# EAGLE design EMP3 (EAGLE 6.6.0)
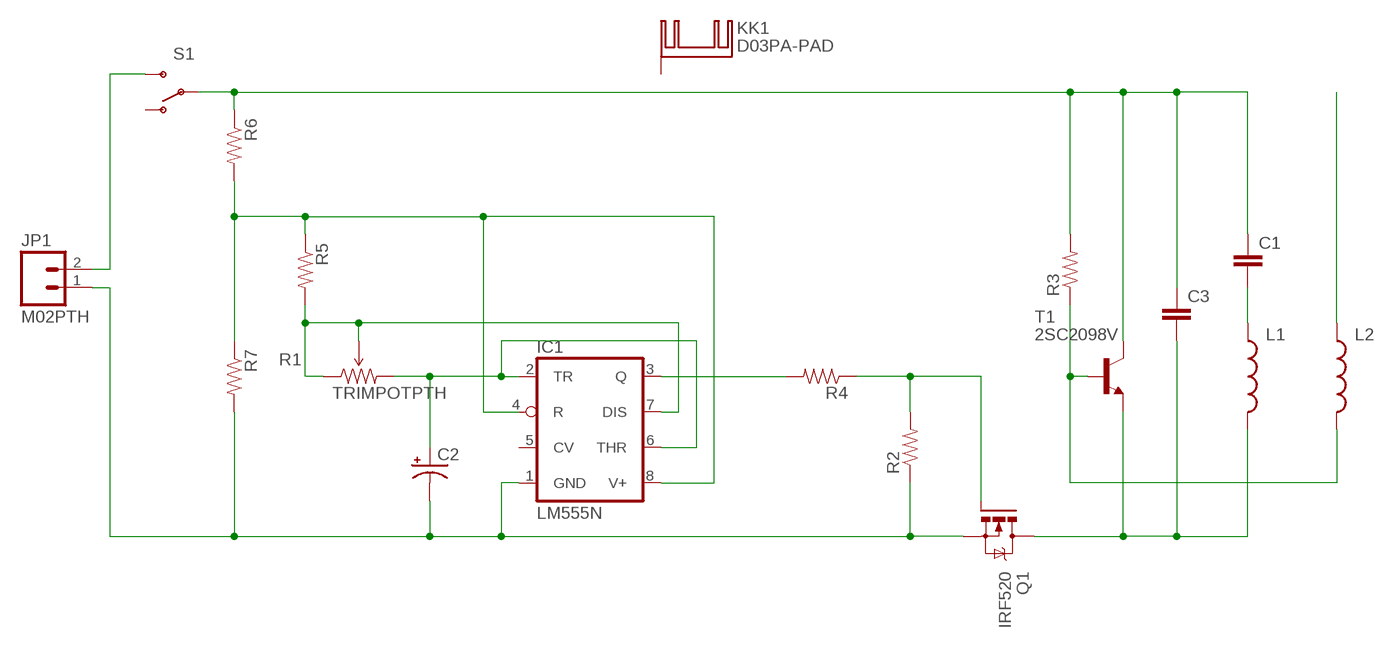
[diagram p0: schematic, sheet 1]

## Parts
C1  CAPEZ  [CAP-PTH-SMALLEZ]
C2  CAP_POLPTH2  [CPOL-RADIAL-10UF-25V]
C3  CAPEZ  [CAP-PTH-SMALLEZ]
IC1  LM555N  [DIL08-ROUND]
JP1  M02PTH  [1X02]
KK1  D03PA-PAD  [D03PA-PAD]
L1  INDUCTORCR54-KIT  [CR54-KIT]
L2  INDUCTORCR54-KIT  [CR54-KIT]
Q1  IRF520  [TO220BV]
R1  TRIMPOTPTH  [TRIM_POT_PTH]
R2  RESISTOREZ  [AXIAL-0.3EZ]
R3  RESISTOREZ  [AXIAL-0.3EZ]
R4  RESISTOREZ  [AXIAL-0.3EZ]
R5  RESISTOREZ  [AXIAL-0.3EZ]
R6  RESISTOREZ  [AXIAL-0.3EZ]
R7  RESISTOREZ  [AXIAL-0.3EZ]
S1  SWITCH-SPDTPTH  [SWITCH-SPDT]
T1  2SC2098V  [TO220AV]

## Nets
GND: C2.2(-) IC1.1(GND) JP1.1 Q1.S R2.P$1 R7.P$2
N$1: C1.2 L1.P$1
N$2: L2.P$1
N$4: L2.P$2 R3.P$1 T1.1(B)
N$6: C3.2 L1.P$2 Q1.D T1.3(E)
N$9: Q1.G R2.P$2 R4.P$1
N$11: IC1.3(Q) R4.P$2
N$13: C2.1(+) IC1.2(TR) IC1.6(THR) R1.3(CW)
N$15: IC1.7(DIS) R1.1(CCW) R1.2(WIPER) R5.P$2
N$18: IC1.4(R) IC1.8(V+) R5.P$1 R6.P$2 R7.P$1
N$22: C1.1 C3.1 R3.P$2 R6.P$1 S1.2(P) T1.2(C)
N$23: JP1.2 S1.3(S)
Unconnected: IC1.5(CV) KK1.B(K) S1.1(O)

## Library data of the parts
C1 C3 = SparkFun-Capacitors:CAP: Capacitor Standard 0603 ceramic capacitor, and 0.1" leaded capacitor.
C2 = SparkFun-Capacitors:CAP_POL: Capacitor Polarized These are standard SMD and PTH capacitors. Normally 10uF, 47uF, and 100uF in electrolytic and tantalum varieties. Always verify the external diameter of the through hole cap, it varies with capacity, voltage, and manufacturer. The EIA devices should be standard.
IC1 = adafruit:*555: TIMER Changed DIP package to have round (not oval) pin pads http://www.ladyada.net/library/pcb/eaglelibrary.html
JP1 = SparkFun-Connectors:M02: Standard 2-pin 0.1" header. Use with - straight break away headers ( PRT-00116) - right angle break away headers (PRT-00553) - swiss pins (PRT-00743) - machine pins (PRT-00117) - female headers (PRT-00115) Molex polarized connector foot print use with: PRT-08233 with associated crimp pins and housings. 2.54_SCREWTERM for use with PRT-10571. 3.5mm Screw Terminal footprints for PRT-08084 5mm Screw Terminal footprints for use with PRT-08433
KK1 = heatsink:D03PA-PAD: HEATSINK distributor Schukat
L1 L2 = SparkFun-Passives:INDUCTOR: Inductors Basic Inductor/Choke - 0603 and 1206. Footprints are not proven and vary greatly between part numbers. SRN6045- 33uH, 20% 1.4A SDR0403-560KL - 56uH, 10%, 500mA RMS/740mA peak
Q1 = transistor-power:IRF520: HEXFET Power MOSFET
R1 = SparkFun-Electromechanical:TRIMPOT: Various small potentiometers for "set-and-forget" applications
R2-R7 = SparkFun-Resistors:RESISTOR: Resistor Basic schematic elements and footprints for 0603, 1206, and PTH resistors.
S1 = SparkFun-Electromechanical:SWITCH-SPDT: SPDT Switch Simple slide switch, Spark Fun Electronics SKU : COM-00102 DPDT SMT slide switch, AYZ0202, SWCH-08179
T1 = transistor:2SC2098: NPN Epitaxial Planar Transistor RF Power Amplivier Source: 2SC2098.pdf

## Board
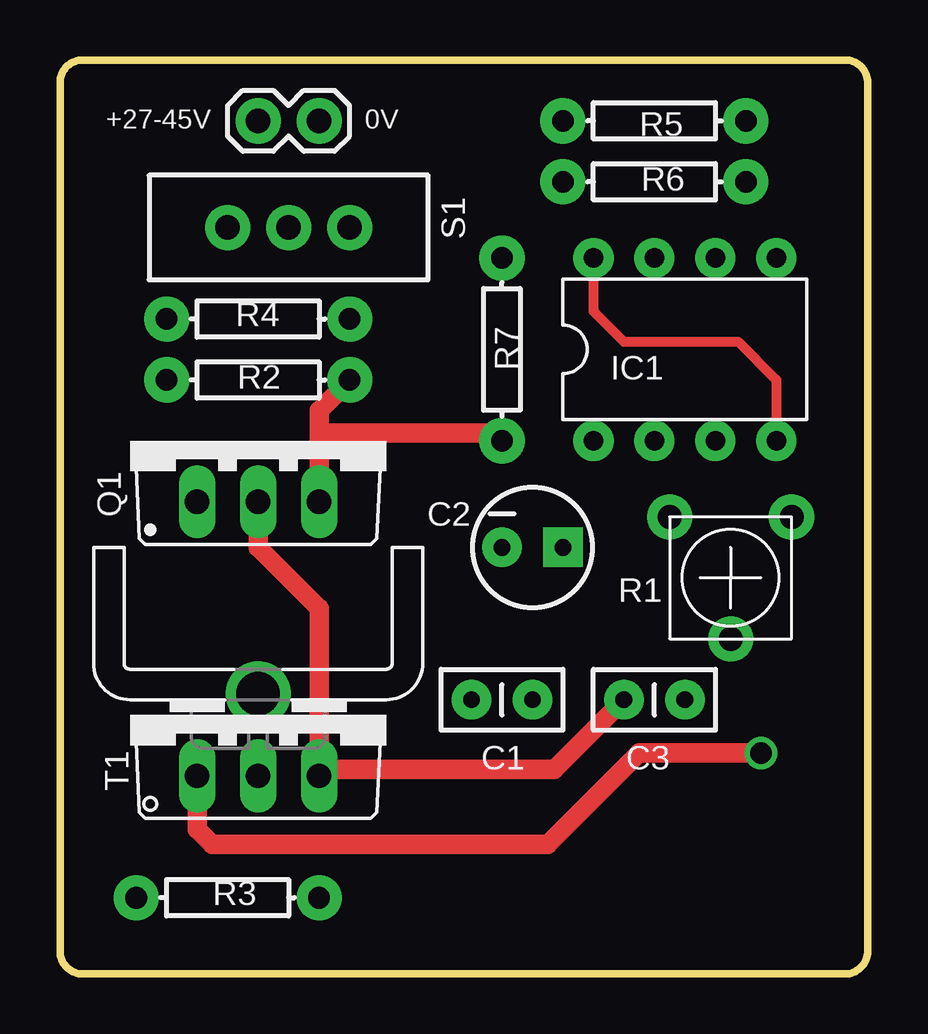
[diagram p1: board, top side]
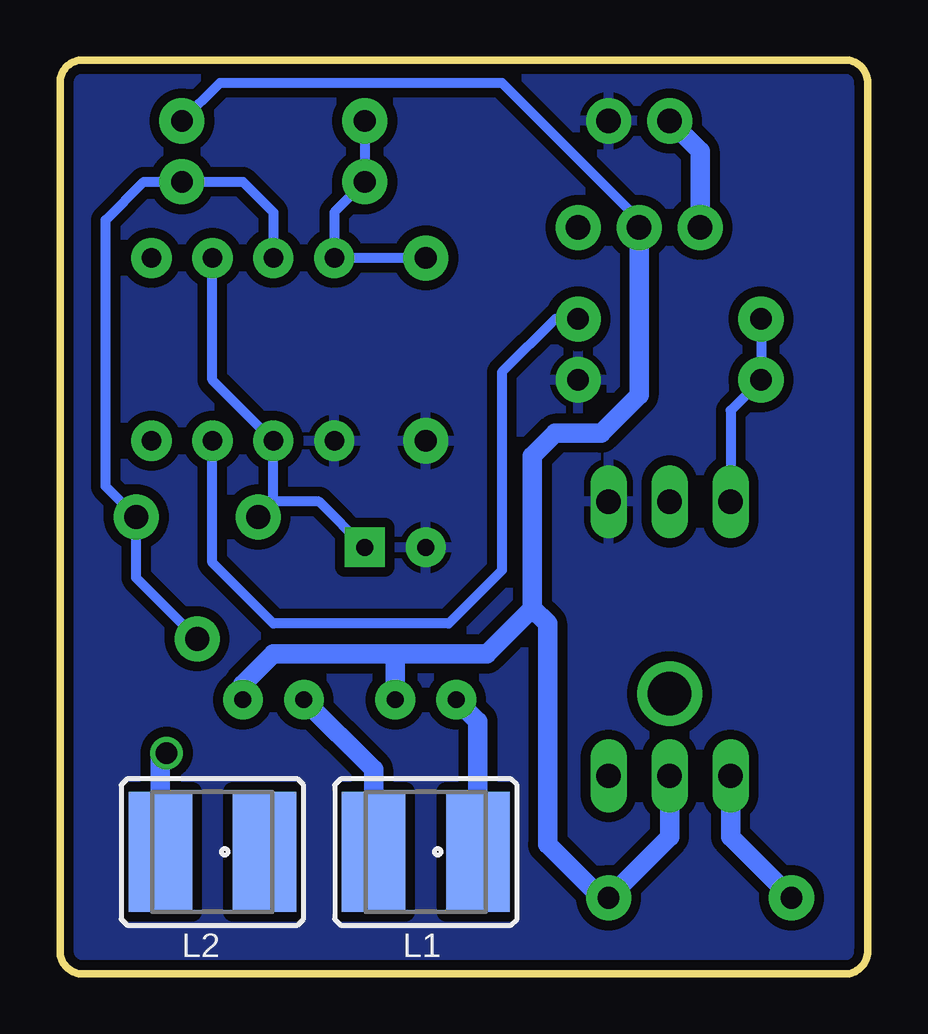
[diagram p2: board, bottom side, seen from below]

Size 33.66 x 38.1 mm. Coordinates in mm from the lower left corner, seen from the top.
Outline: 0,37.15 0,0.95 arc90 0.95,0 32.7,0 arc90 33.66,0.95 33.66,37.15 arc90 32.7,38.1 0.95,38.1 arc90 0,37.15
Copper layers (1*16): Top 0.035mm / dielectric 1.5mm / Bottom 0.035mm
Design rules "SeeedStudio_2layer_DRU_no_angle_20140221": minimum track width 6mil, minimum drill 12mil, track to track 6mil, track to pad 6mil, pad to pad 6mil, via to via 6mil, smd to smd 0mil, copper to edge 10mil, drill to drill 10mil, minimum pad ring 10mil, minimum via ring 6mil, stop-mask expansion 2mil, vias tented up to drill 100mil, thermal gap 10mil

### Footprints (pad centres in the part's own frame; a part is rotated, then mirrored left to right if it is on the bottom)
CAP-PTH-SMALLEZ = drill 0.7 pad 1.651: 1 0,0; 2 2.54,0
CPOL-RADIAL-10UF-25V = drill 0.7 pad 1.651 square: 1 1.27,0 | drill 0.7 pad 1.651: 2 -1.27,0
DIL08-ROUND = drill 0.813 pad 1.676: 1 -3.81,-3.81; 2 -1.27,-3.81; 3 1.27,-3.81; 4 3.81,-3.81; 5 3.81,3.81; 6 1.27,3.81; 7 -1.27,3.81; 8 -3.81,3.81
1X02 = drill 1.016 pad 1.88: 1 0,0; 2 2.54,0
D03PA-PAD = drill 1.803 pad 2.54: B 0,-1.016
CR54-KIT = smd 5 x 2.65: P$1 0,2.17; P$2 0,-2.17
TO220BV = drill 1.016 long: D 0,-2.54; G -2.54,-2.54; S 2.54,-2.54
TRIM_POT_PTH = drill 1 pad 1.88: 1 -2.54,-2.54; 2 0,2.54; 3 2.54,-2.54
AXIAL-0.3EZ = drill 0.9 pad 1.88: P$1 -3.81,0; P$2 3.81,0
SWITCH-SPDT = drill 1.016 pad 1.88: 1 0,2.54; 2 0,0; 3 0,-2.54
TO220AV = drill 1.016 long: 1 -2.54,-2.54; 2 0,-2.54; 3 2.54,-2.54

### Placement (x,y rotation side)
C1  19.68,11.43 180 top
C2  19.68,17.78 0 top
C3  26.04,11.43 180 top
IC1  26.04,26.04 0 top
JP1  10.79,35.56 180 top
KK1  8.26,12.7 0 top
L1  18.41,5.08 270 bottom
L2  27.3,5.08 270 bottom
Q1  8.26,22.23 0 top
R1  27.94,16.51 180 top
R2  8.26,24.77 180 top
R3  6.99,3.17 0 top
R4  8.26,27.3 0 top
R5  24.77,33.02 0 top
R6  24.77,35.56 180 top
R7  18.41,26.04 270 top
S1  9.53,31.11 270 top
T1  8.26,10.79 0 top

### Tracks (layer width: path | path; a pad name or v marks a point on that pad's centre or on a via)
GND
  Top 0.813: R2.P$1 10.79,23.5 10.79,22.54 | 10.79,22.54 Q1.S | R7.P$2 18.1,22.54 10.79,22.54
  pour Bottom (isolate 0.406): 33.66,37.15 33.66,0.95 arc-90 32.7,0 0.95,0 arc-90 0,0.95 0,37.15 arc-90 0.95,38.1 32.7,38.1 arc-90
N$1
  Bottom 0.813: C1.2 16.25,10.53 L1.P$1
N$4  (via drill 0.9)
  Top 0.813: v29.21,9.21 24.13,9.21 20.32,5.4 6.35,5.4 5.71,6.03 T1.1
  Bottom 0.813: R3.P$1 5.71,5.71 T1.1 | L2.P$2 29.48,8.94 v29.21,9.21
N$6
  Top 0.813: Q1.D 8.26,17.78 10.79,15.24 T1.3 11.06,8.52 20.59,8.52 C3.2
  Bottom 0.813: C3.2 20.59,8.52 L1.P$2
N$9
  Bottom 0.406: R4.P$1 R2.P$2 5.71,23.5 Q1.G
N$11
  Bottom 0.406: R4.P$2 13.02,27.3 15.24,25.08 15.24,16.83 17.46,14.61 24.77,14.61 27.3,17.14 IC1.3
N$13
  Bottom 0.406: C2.1 22.86,19.68 24.77,19.68 | 24.77,19.68 IC1.2 27.3,24.77 IC1.6 | R1.3 24.77,19.68
N$15
  Bottom 0.406: IC1.7 24.77,31.75 26.04,33.02 R5.P$2 30.16,33.02 31.75,31.43 31.75,20.32 R1.1 30.48,16.51 R1.2
N$18
  Top 0.406: IC1.8 22.23,27.62 23.5,26.35 28.26,26.35 29.84,24.77 IC1.4
  Bottom 0.406: R6.P$2 R5.P$1 22.23,31.75 IC1.8 R7.P$1
N$22
  Bottom 0.406: R6.P$1 26.99,37.15 15.24,37.15 9.53,31.43 S1.2
  Bottom 0.813: S1.2 9.53,24.13 11.11,22.54 13.02,22.54 13.97,21.59 13.97,15.24 | 13.97,15.24 15.88,13.34 19.68,13.34 | 19.68,13.34 C1.1 | 8.26,8.57 T1.2 8.26,5.71 R3.P$2 11.11,3.17 13.34,5.4 13.34,14.61 13.97,15.24 | C3.1 26.04,12.06 24.77,13.34 19.68,13.34
N$23
  Bottom 0.813: JP1.2 6.99,34.29 S1.3

### Text on the board
tPlace: +27-45V | 0V